# EAGLE design espism (EAGLE 6.5.0)
CNAME: An ISM to Wifi gateway; CREVISION: 1; DESIGNER: Johan Kanflo
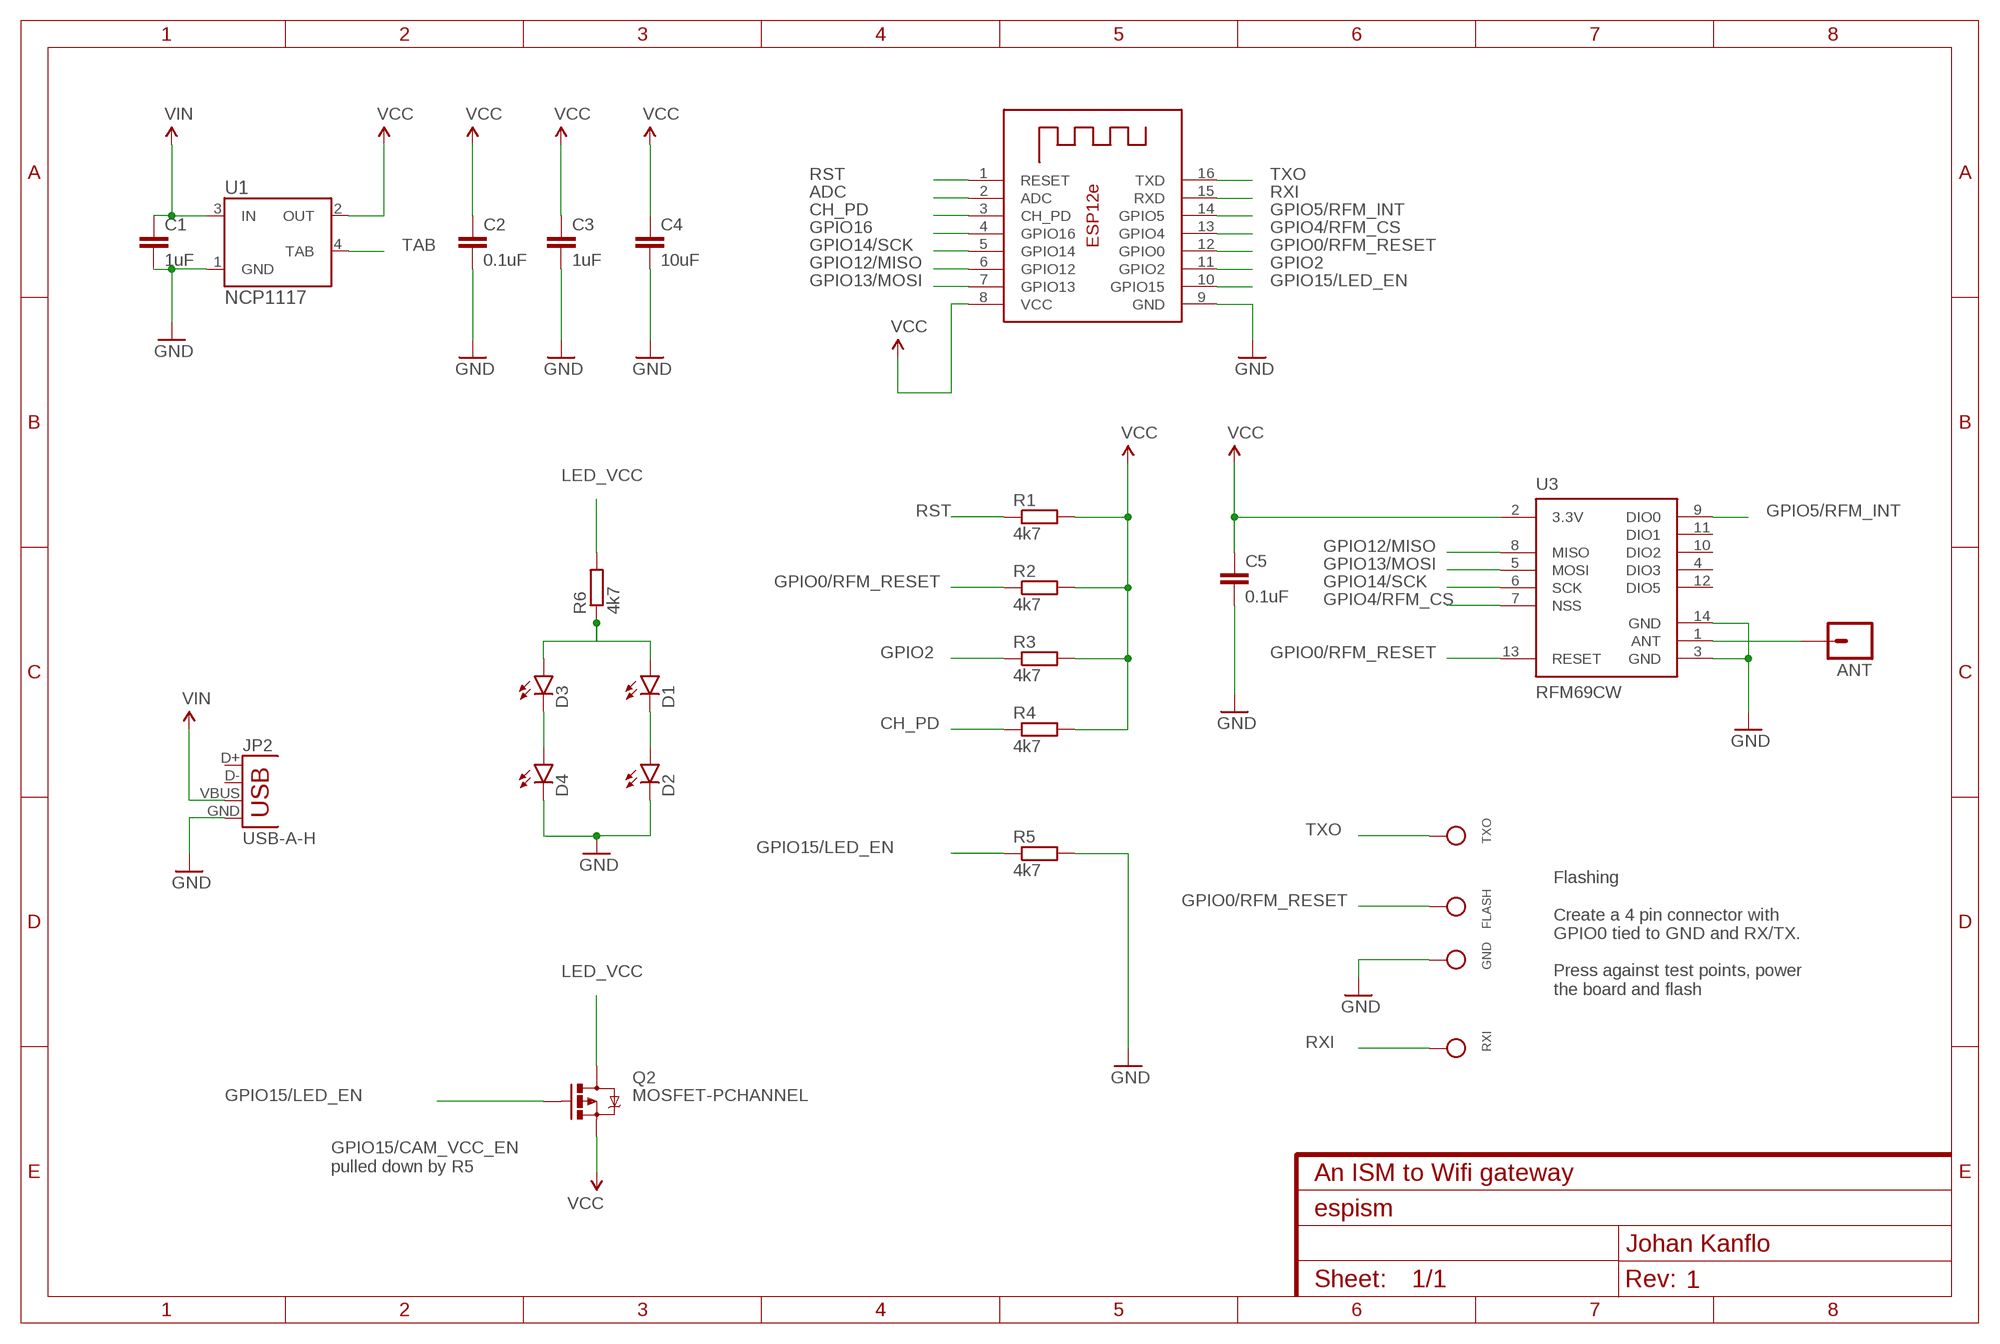
[diagram p0: schematic, sheet 1]

## Parts
ANT  M01PTH  [1X01]
C1  1uF  CAP0603-CAP  [0603-CAP]
C2  0.1uF  CAP0603-CAP  [0603-CAP]
C3  1uF  CAP0603-CAP  [0603-CAP]
C4  10uF  CAP0603-CAP  [0603-CAP]
C5  0.1uF  CAP0603-CAP  [0603-CAP]
D1  LED0603  [LED-0603]
D2  LED0603  [LED-0603]
D3  LED0603  [LED-0603]
D4  LED0603  [LED-0603]
FLASH  TESTPOINTROUND1MM  [TESTPOINT_ROUND_1MM]
GND  TESTPOINTROUND1MM  [TESTPOINT_ROUND_1MM]
JP2  USB-A-H  [USB-A-H]
Q2  MOSFET-PCHANNEL  [SOT23-3]
R1  4k7  R-EU_R0603  [R0603]
R2  4k7  R-EU_R0603  [R0603]
R3  4k7  R-EU_R0603  [R0603]
R4  4k7  R-EU_R0603  [R0603]
R5  4k7  R-EU_R0603  [R0603]
R6  4k7  R-EU_R0603  [R0603]
RXI  TESTPOINTROUND1MM  [TESTPOINT_ROUND_1MM]
TXO  TESTPOINTROUND1MM  [TESTPOINT_ROUND_1MM]
U1  NCP1117  [SOT223]
U2  ESP-12E  [ESP-12E]
U3  RFM69CW  [RFM69CW-XXXS2]

## Nets
ADC: U2.2(ADC)
CH_PD: R4.1 U2.3(CH_PD)
GND: C1.2 C2.2 C3.2 C4.2 C5.2 D2.C D4.C GND.P$1 JP2.GND R5.2 U1.1(GND) U2.9(GND) U3.3(GND) U3.14(GND)
GPIO0/RFM_RESET: FLASH.P$1 R2.1 U2.12(GPIO0) U3.13(RESET)
GPIO2: R3.1 U2.11(GPIO2)
GPIO4/RFM_CS: U2.13(GPIO4) U3.7(NSS)
GPIO5/RFM_INT: U2.14(GPIO5) U3.9(DIO0)
GPIO12/MISO: U2.6(GPIO12) U3.8(MISO)
GPIO13/MOSI: U2.7(GPIO13) U3.5(MOSI)
GPIO14/SCK: U2.5(GPIO14) U3.6(SCK)
GPIO15/LED_EN: Q2.1(G) R5.1 U2.10(GPIO15)
GPIO16: U2.4(GPIO16)
LED_VCC: Q2.3(D) R6.2
N$1: ANT.1 U3.1(ANT)
N$2: D1.A D3.A R6.1
N$3: D1.C D2.A
N$5: D3.C D4.A
RST: R1.1 U2.1(RESET)
RXI: RXI.P$1 U2.15(RXD)
TAB: U1.4(TAB)
TXO: TXO.P$1 U2.16(TXD)
VCC: C2.1 C3.1 C4.1 C5.1 Q2.2(S) R1.2 R2.2 R3.2 R4.2 U1.2(OUT) U2.8(VCC) U3.2(3.3V)
VIN: C1.1 JP2.VBUS U1.3(IN)
Unconnected: JP2.D+ JP2.D- U3.4(DIO3) U3.10(DIO2) U3.11(DIO1) U3.12(DIO5)

## Notes on the sheet
- Flashing
  
  Create a 4 pin connector with
  GPIO0 tied to GND and RX/TX.
  
  Press against test points, power
  the board and flash
- GPIO15/CAM_VCC_EN
  pulled down by R5

## Library data of the parts
ANT = SparkFun-Connectors:M01: Header 1 Standard 1-pin 0.1" header. Use with straight break away headers (SKU : PRT-00116), right angle break away headers (PRT-00553), swiss pins (PRT-00743), machine pins (PRT-00117), and female headers (PRT-00115).
C1-C5 = SparkFun-Capacitors:CAP: Capacitor Standard 0603 ceramic capacitor, and 0.1" leaded capacitor.
D1-D4 = SparkFun-LED:LED: LEDs Standard schematic elements and footprints for 5mm, 3mm, 1206, and 0603 sized LEDs. 5mm - Spark Fun Electronics SKU : COM-00529 (and others)
FLASH GND RXI TXO = microbuilder:TESTPOINT: Test Point Various test points for characterisation and PCB testing TESTPOINT_SMT - Compact Surface Mount Test Point [Digikey: 5016KTR-ND]
JP2 = SparkFun-Connectors:USB: USB Connectors USB-B-PTH is fully proven SKU : PRT-00139/CONN-08278 USB-miniB is fully proven SKU : PRT-00587 USB-A-PCB is untested. USB-A-H is throughly reviewed, but untested. Spark Fun Electronics SKU : PRT-00437 USB-B-SMT is throughly reviewed, but untested. Needs silkscreen touching up. USB-A-S has not been used/tested USB-MB-H has not been used/tested USB-MICROB has been used. CONN-09505; PROD_ID: CONN-08367
Q2 = SparkFun-DiscreteSemi:MOSFET-PCHANNEL: Generic PMOSFET IRLML2244 - TRANS-11153 (SOT-23 -20V -4.3A) (1.Gate 2.Source 3.Drain) FQP27P06 - COM-10349 <http://www.sparkfun.com/products/10349> (TO-220 -60V -27A) (1.Gate 2.Source 3.Drain); PROD_ID: TRANS-08285
R1-R6 = resistor:R-EU_: RESISTOR, European symbol
U1 = ELL-i-PowerIC:NCP1117
U2 = kanflo:ESP-12E: ESP12e module This is a copy of AdaFruit's device with correct pin order for GPIO4 and GPIO5.
U3 = SparkFun-RF:RFM69

## Board
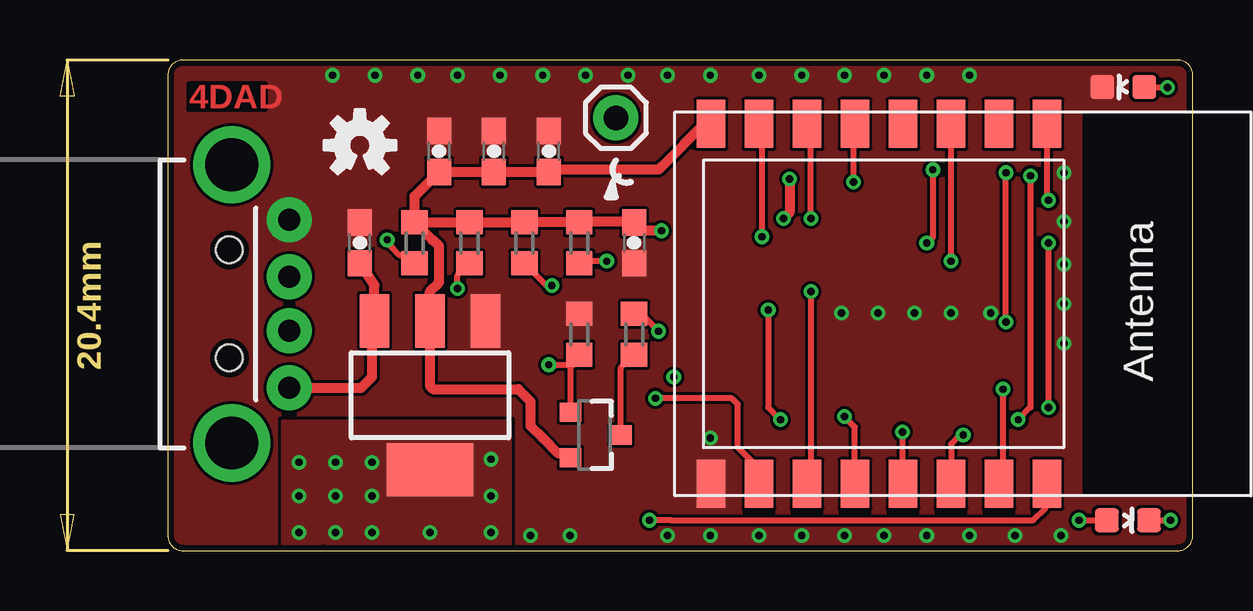
[diagram p1: board, top side]
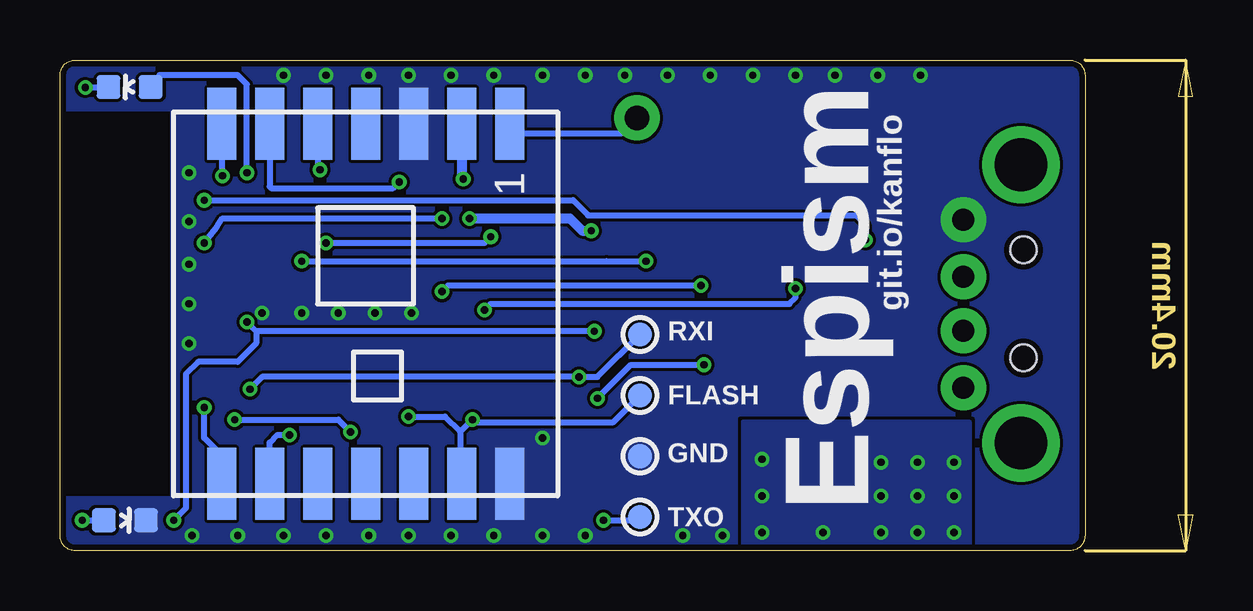
[diagram p2: board, bottom side, seen from below]

Size 42.71 x 20.45 mm. Coordinates in mm from the lower left corner, seen from the top.
Outline: 0.63,0 6.48,0 42.08,0 arc90 42.71,0.64 42.71,19.81 arc90 42.08,20.45 5.84,20.45 0.63,20.45 arc90 0,19.81 0,0.64 arc90 0.63,0
Copper layers (1*16): Top 0.035mm / dielectric 1.5mm / Bottom 0.035mm
Design rules "dirt_cheap_dirty_boards.v1": minimum track width 5mil, minimum drill 12mil, track to track 5mil, track to pad 5mil, pad to pad 5mil, via to via 5mil, smd to smd 0mil, copper to edge 10mil, drill to drill 10mil, minimum pad ring 10mil, minimum via ring 6mil, stop-mask expansion 2mil, vias tented up to drill 25mil, thermal gap 10mil

### Footprints (pad centres in the part's own frame; a part is rotated, then mirrored left to right if it is on the bottom)
1X01 = drill 1.016 pad 1.88: 1 0,0
0603-CAP = smd 1.1 x 1: 1 -0.85,0; 2 0.85,0
LED-0603 = smd 1 x 1: A 0,-0.877; C 0,0.877
TESTPOINT_ROUND_1MM = smd 1 x 1: P$1 0,0
USB-A-H = drill 0.914 pad 1.88: D+ 2.4,1.127; D- 2.4,-1.127; GND 2.4,3.5; VBUS 2.4,-3.5 | drill 2.2: GND2 0,-5.8; GND3 0,5.8 | hole 1.1: -0.1,2.25; -0.1,-2.25
SOT23-3 = smd 0.8 x 0.9: 1 -0.95,-1; 2 0.95,-1; 3 0,1.1
R0603 = smd 1 x 1.1: 1 -0.85,0; 2 0.85,0
SOT223 = smd 1.219 x 2.235: 1 -2.311,-3.099; 2 0,-3.099; 3 2.311,-3.099 | smd 3.6 x 2.2: 4 0,3.099
ESP-12E = smd 2 x 1.2: 1 -7.5,4.5; 2 -7.5,2.5; 3 -7.5,0.5; 4 -7.5,-1.5; 5 -7.5,-3.5; 6 -7.5,-5.5; 7 -7.5,-7.5; 8 -7.5,-9.5; 9 7.5,-9.5; 10 7.5,-7.5; 11 7.5,-5.5; 12 7.5,-3.5; 13 7.5,-1.5; 14 7.5,0.5; 15 7.5,2.5; 16 7.5,4.5
RFM69CW-XXXS2 = smd 3 x 1.2: 1 -7.5,6; 2 -7.5,4; 3 -7.5,2; 4 -7.5,0; 5 -7.5,-2; 6 -7.5,-4; 7 -7.5,-6; 8 7.5,-6; 9 7.5,-4; 10 7.5,-2; 11 7.5,0; 12 7.5,2; 13 7.5,4; 14 7.5,6

### Placement (x,y rotation side)
ANT  18.67,18.03 0 top
C1  8,12.83 90 top
C2  15.88,16.64 90 top
C3  13.59,16.64 90 top
C4  11.3,16.64 90 top
C5  19.43,12.83 270 top
D1  39.81,19.32 90 bottom
D2  39.81,19.32 90 top
D3  40,1.27 270 top
D4  40,1.27 270 bottom
FLASH  18.54,6.48 0 bottom
GND  18.54,3.94 0 bottom
JP2  2.67,10.29 0 top
Q2  17.78,4.83 270 top
R1  10.29,12.83 90 top
R2  12.57,12.83 90 top
R3  14.86,12.83 90 top
R4  17.14,12.83 90 top
R5  17.14,9.02 90 top
R6  19.43,9.02 270 top
RXI  18.54,9.02 0 bottom
TXO  18.54,1.4 0 bottom
U1  10.92,6.48 180 top
U2  32.13,10.29 270 top
U3  29.97,10.29 270 bottom
U$1  [OSHW-LOGO-S]  8,16.89 0 top

### Tracks (layer width: path | path; a pad name or v marks a point on that pad's centre or on a via)
CH_PD  (via drill 0.3 pad 0.25)
  Top 0.254: U2.3 v32.63,12.07 v32.64,12.07 | v18.29,12.07 17.23,12.07 R4.1
  Bottom 0.254: v18.29,12.07 19.94,12.07 v32.64,12.07
GND  (via drill 0.3 pad 0.25)
  other vias: 22.61,4.7 37.21,0.64 33.4,19.81 31.62,19.81 29.84,19.81 28.19,19.81 26.42,19.81 24.64,19.81 35.31,0.64 33.4,0.64 31.62,0.64 29.84,0.64 28.19,0.64 26.42,0.64 24.64,0.64 22.61,0.64 20.83,0.64 16.76,0.64 15.11,0.64 13.84,19.81 12.06,19.81 10.41,19.81 8.64,19.81 6.86,19.81 22.61,19.81 20.83,19.81 19.18,19.81 17.4,19.81 15.62,19.81 37.34,8.64 37.34,10.29 37.34,11.94 37.34,13.72 37.34,15.75 28.07,9.91 29.59,9.91 31.12,9.91 32.64,9.91 34.29,9.91
  pour Bottom (rank 6, no thermals): 0,20.45 42.71,20.45 42.71,0 0,0
  pour Top (rank 6, no thermals): 0,20.45 42.71,20.45 42.71,0 0,0
GPIO0/RFM_RESET  (via drill 0.3 pad 0.25)
  Top 0.254: U2.12 28.63,5.15 v28.19,5.59 | v25.02,10.03 25.02,5.97 v25.53,5.46 | v12.06,10.92 12.06,11.47 R2.1
  Bottom 0.254: v28.19,5.59 26.67,5.59 26.03,4.95 | 26.03,4.95 26.03,2.85 U3.13 | v25.02,10.03 24.77,10.29 14.86,10.29 12.32,10.29 12.06,10.54 v12.06,10.92 | 26.03,4.95 v25.53,5.46 25.4,5.33 19.68,5.33 FLASH.P$1
GPIO2  (via drill 0.3 pad 0.25)
  Top 0.254: v16,11.05 15.79,11.05 R3.1 | v26.8,10.79 26.8,2.95 U2.11
  Bottom 0.254: v16,11.05 26.54,11.05 v26.8,10.79
GPIO4/RFM_CS  (via drill 0.3 pad 0.25)
  Top 0.254: v35.94,15.62 35.94,5.97 v35.43,5.46 | v30.61,4.95 30.61,2.81 U2.13
  Bottom 0.254: U3.7 35.97,15.65 v35.94,15.62 | v35.43,5.46 31.12,5.46 v30.61,4.95
GPIO5/RFM_INT  (via drill 0.3 pad 0.25)
  Top 0.254: v33.15,4.83 33.02,4.83 32.64,4.44 U2.14
  Bottom 0.254: v33.15,4.83 33.66,4.83 33.97,4.51 U3.9
GPIO12/MISO  (via drill 0.3 pad 0.25)
  Top 0.254: v36.7,5.97 v36.7,12.83 | v26.8,13.84 26.8,17.62 U2.6
  Bottom 0.254: U3.8 35.97,3.97 36.7,4.7 v36.7,5.97 | v36.7,12.83 36.2,13.46 35.94,13.84 27.3,13.84 v26.8,13.84
GPIO13/MOSI  (via drill 0.3 pad 0.25)
  Top 0.254: v31.88,15.87 31.88,13.08 v31.62,12.83 | v24.77,13.08 24.77,17.65 U2.7
  Bottom 0.254: U3.5 31.97,15.97 v31.88,15.87 | v31.62,12.83 25.02,12.83 v24.77,13.08
GPIO14/SCK  (via drill 0.3 pad 0.25)
  Top 0.254: v28.57,15.37 28.57,17.73 U2.5
  Bottom 0.254: U3.6 33.97,15.18 33.91,15.11 28.83,15.11 v28.57,15.37
GPIO15/LED_EN  (via drill 0.3 pad 0.25)
  Top 0.254: U2.10 24.63,3.44 23.75,4.32 23.75,6.1 23.49,6.35 v20.32,6.35 | v15.88,7.75 16.73,7.75 R5.1 16.89,7.91 16.89,7.75 16.78,7.64 Q2.1
  Bottom 0.254: v20.32,6.35 18.92,7.75 v15.88,7.75
LED_VCC
  Top 0.254: Q2.3 18.88,7.62 R6.2
N$1
  Bottom 0.254: 23.85,17.91 U3.1 23.58,17.4 19.3,17.4 ANT.1
N$2  (via drill 0.3 pad 0.25)
  Top 0.254: R6.1 19.72,9.87 v20.45,9.14 | v34.92,9.53 v34.92,15.75 | v37.97,1.27 D3.A
  Bottom 0.254: v20.45,9.14 34.54,9.14 | 34.54,9.14 v34.92,9.53 | v34.92,15.75 34.92,19.43 35.31,19.81 38.57,19.81 D1.A | 34.54,9.14 34.54,8.64 35.31,7.87 36.96,7.87 37.46,7.37 37.46,1.78 v37.97,1.27
N$3  (via drill 0.3 pad 0.25)
  Top 0.254: D2.A 41.64,19.32 v41.66,19.3
  Bottom 0.254: v41.66,19.3 40.71,19.3 D2.A
N$5  (via drill 0.3 pad 0.25)
  Top 0.254: D4.A v41.78,1.27
  Bottom 0.254: v41.78,1.27 D4.A
RST  (via drill 0.3 pad 0.25)
  Top 0.254: U2.1 36.63,14.68 v36.7,14.61 | v9.14,12.95 9.14,12.83 9.4,12.57 9.65,12.32 9.95,12.32 R1.1
  Bottom 0.254: v36.7,14.61 21.34,14.61 20.7,13.97 9.52,13.97 9.14,13.59 v9.14,12.95
RXI  (via drill 0.3 pad 0.25)
  Top 0.254: v34.8,6.73 34.8,2.95 U2.15
  Bottom 0.254: v34.8,6.73 34.29,7.24 v21.08,7.24 20.32,7.24 RXI.P$1
TAB  (via drill 0.3 pad 0.25)
  other vias: 6.98,3.68 8.51,3.68 6.98,2.29 8.51,2.29 13.46,2.29 6.98,0.76 8.51,0.76 10.92,0.76 13.46,0.76 5.46,3.68 5.46,2.29 5.46,0.76 13.46,3.81
  pour Top (no thermals): 14.22,5.33 4.83,5.33 4.83,0 14.22,0
  pour Bottom (no thermals): 4.83,5.33 14.22,5.33 14.22,0 4.83,0
TXO  (via drill 0.3 pad 0.25)
  Top 0.254: U2.16 36.58,2.73 36.58,1.78 36.07,1.27 20.95,1.27 v20.07,1.27
  Bottom 0.254: v20.07,1.27 18.67,1.27 TXO.P$1
VCC  (via drill 0.3 pad 0.25)
  Top 0.406: U2.8 22.36,17.79 20.57,16 20.45,15.87 15.96,15.87 C2.1 C3.1 C4.1 10.29,14.77 R1.2 | R1.2 R2.2 R3.2 R4.2 17.18,13.72 19.18,13.72 19.3,13.84 19.6,13.84 C5.1 19.77,13.33 v20.57,13.33 | R1.2 11.01,12.95 11.05,12.95 11.3,12.7 11.3,11.18 10.92,10.79 U1.2 10.92,6.86 11.05,6.73 14.6,6.73 15.11,6.22 15.11,5.21 15.62,4.7 16.26,4.06 16.59,4.06 Q2.2 | v25.91,15.49 25.91,14.1 v25.65,13.84
  Bottom 0.406: U3.2 25.97,15.56 v25.91,15.49 | v25.65,13.84 21.46,13.84 20.95,13.33 v20.57,13.33
VIN
  Top 0.406: JP2.VBUS 8.06,6.79 8.51,7.24 8.51,9.47 U1.3 8.61,11.06 C1.1

### Text on the board
Top: 4DAD
bNames: git.io/kanflo | Espism